# Altium schematic sheet SC945D_Backlight.SchDoc: Backlight
size 393 x 270 mm; CompanyName: Seccom; Address1: 521, rue du capt. François Garbit; Address2: 69440 Mornant; Address3: seccom@seccom.fr; Address4: www.seccom.fr; DocumentNumber: 8; SheetNumber: 8; SheetTotal: 9; PageSetup: Record=PageOptions|CenterHorizontal=True|CenterVertical=True|PrintScale=0.74|XCorrection=1.00|YCorrection=1.00|PrintKind=0|BorderSize=5000000|LeftOffset=0|BottomOffset=0|Orientation=2|PaperLength=1000|PaperWidth=1000|Scale=100|PaperSource=7|PrintQuality=-4|MediaType=1|DitherType=10|PaperKind=A4|PrintScaleMode=1
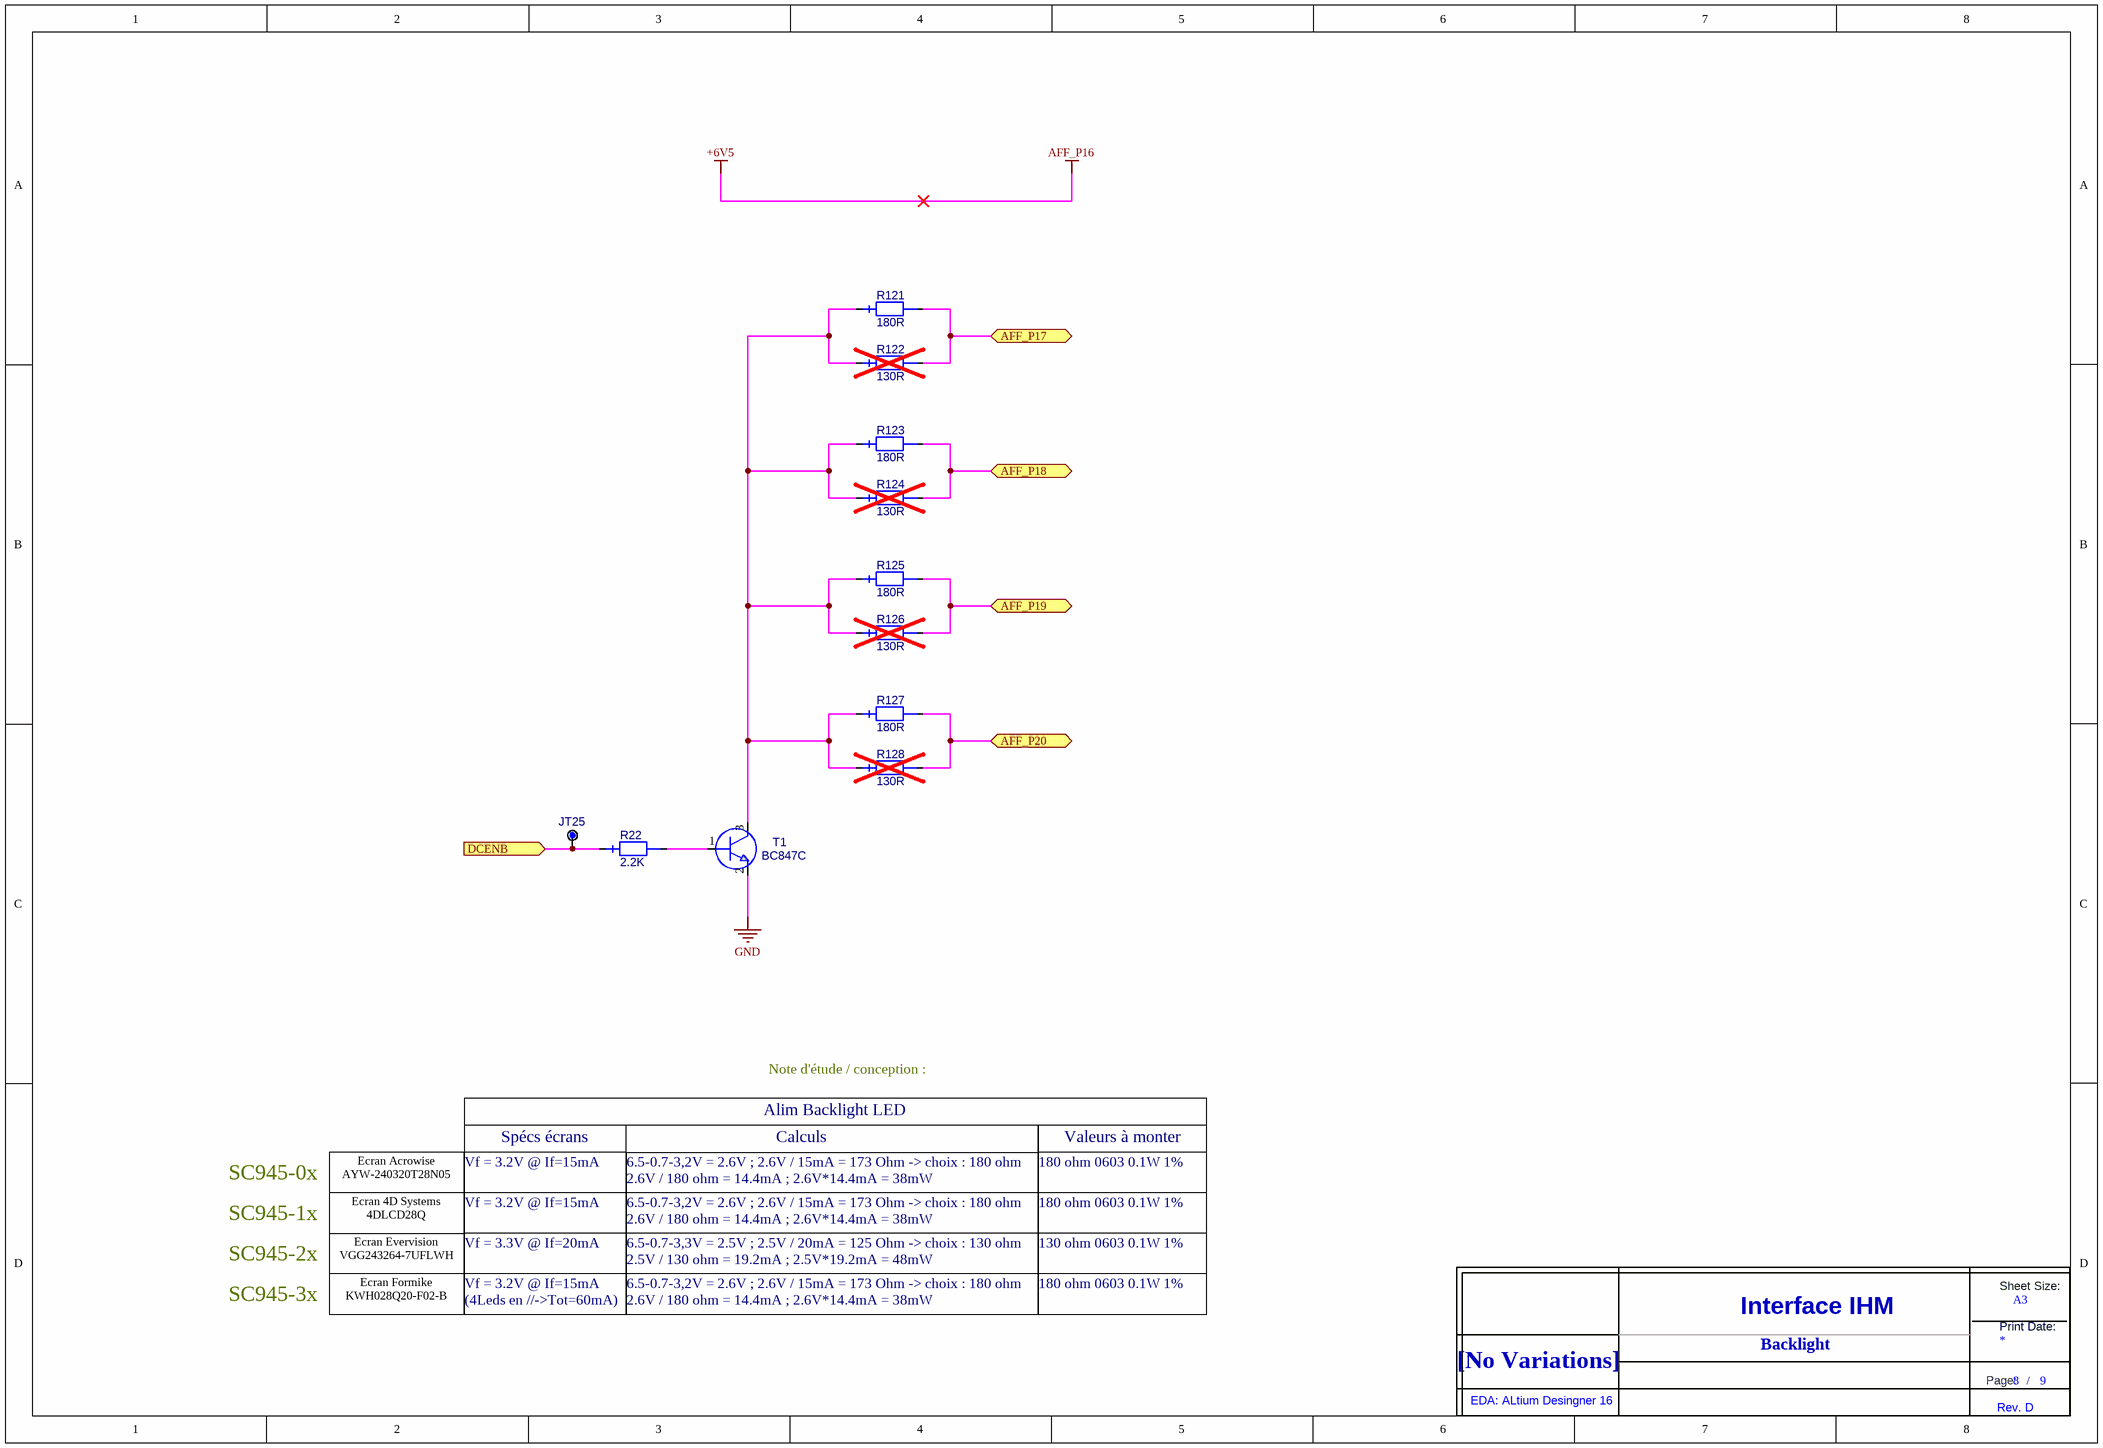
[diagram p0: SC945D_Backlight.SchDoc]

## Parts
JT25  POINT_TEST_PAD_40MIL  [PAD_CMS_40X40_E]  (value not drawn)  (no BOM)
R22  value 2.2K  [0603_ReflowSoldering_RES]  (hidden comment: RES_0603_1%_100PPM_2.2K)
R121  value 180R  [0603_ReflowSoldering_RES]  (hidden comment: RES_0603_1%_100PPM_180R)
R122  value 130R  [0603_ReflowSoldering_RES]  (hidden comment: RES_0603_1%_100PPM_130R)  (no BOM)
R123  value 180R  [0603_ReflowSoldering_RES]  (hidden comment: RES_0603_1%_100PPM_180R)
R124  value 130R  [0603_ReflowSoldering_RES]  (hidden comment: RES_0603_1%_100PPM_130R)  (no BOM)
R125  value 180R  [0603_ReflowSoldering_RES]  (hidden comment: RES_0603_1%_100PPM_180R)
R126  value 130R  [0603_ReflowSoldering_RES]  (hidden comment: RES_0603_1%_100PPM_130R)  (no BOM)
R127  value 180R  [0603_ReflowSoldering_RES]  (hidden comment: RES_0603_1%_100PPM_180R)
R128  value 130R  [0603_ReflowSoldering_RES]  (hidden comment: RES_0603_1%_100PPM_130R)  (no BOM)
T1  BC847C  [SOT23_3L_ReflowSoldering]
Title_new?  DNI  (value not drawn)  (graphical)

## Ports
AFF_P17 (bidir), AFF_P18 (bidir), AFF_P19 (bidir), AFF_P20 (bidir), DCENB (in)

## Nets
GND: T1.2(E)
AFF_P17: R121.2 R122.2 ; port AFF_P17
AFF_P18: R123.2 R124.2 ; port AFF_P18
AFF_P19: R125.2 R126.2 ; port AFF_P19
AFF_P20: R127.2 R128.2 ; port AFF_P20
DCENB: JT25.1 R22.1 ; port DCENB
NetR22_2: R22.2 T1.1(B)
NetR121_1: R121.1 R122.1 R123.1 R124.1 R125.1 R126.1 R127.1 R128.1 T1.3(C)

## Notes on the sheet
- Alim Backlight LED
- Note d'étude / conception :
- SC945-0x
- Ecran Acrowise
  AYW-240320T28N05
- Spécs écrans
- Vf = 3.2V @ If=15mA
- Calculs
- 6.5-0.7-3,2V = 2.6V ; 2.6V / 15mA = 173 Ohm -> choix : 180 ohm
  2.6V / 180 ohm = 14.4mA ; 2.6V*14.4mA = 38mW
- Valeurs à monter
- 180 ohm 0603 0.1W 1%
- SC945-1x
- SC945-2x
- Ecran 4D Systems
  4DLCD28Q
- SC945-3x
- Ecran Evervision
  VGG243264-7UFLWH
- Ecran Formike
  KWH028Q20-F02-B
- Vf = 3.3V @ If=20mA
- Vf = 3.2V @ If=15mA
  (4Leds en //->Tot=60mA)
- 6.5-0.7-3,3V = 2.5V ; 2.5V / 20mA = 125 Ohm -> choix : 130 ohm
  2.5V / 130 ohm = 19.2mA ; 2.5V*19.2mA = 48mW
- 130 ohm 0603 0.1W 1%
- Backlight
- (in symbol Title_new) Sheet Size:; A3; Interface IHM; Print Date:; [No Variations]; Page:; /; EDA: ALtium Desingner 16; Rev. D

## Library data of the parts
JT25 = POINT_TEST_PAD_40MIL: Point de test sur CI, pad de diamètre 1.016mm (40mils); Creation: FB (04/10/12); Remarque: {Remarque}; Coeff: 1; Value: POINT_TEST; Config: *; ComponentLink1Description: Datasheet; ComponentLink2Description: Datasheet Boitier
R22 = RES_0603_1%_100PPM_2.2K: Résistance, 0.100W, 1%, 100ppm, 75V, 2.2K; Creation: JPL (05/07/12); Boitier: 0603; Remarque: {Remarque}; Fabricant: Vishay; Ref Fab: CRCW06032K20FKEA; Coeff: 1; Verification: *; ComponentLink1URL: O:\_Documentation\Datasheets\Vishay\Resistances_D-CRCWe3.pdf; ComponentLink2URL: o:\_Documentation\Datasheets\_BOITIERS\PASSIF_CMS\; Config: *; ComponentLink1Description: Datasheet; ComponentLink2Description: Datasheet Boitier; Supplier 1: Farnell; Supplier 2: RadioSpares; Supplier Part Number 1: 1469765; Supplier Part Number 2: 6790112
R121 R123 R125 R127 = RES_0603_1%_100PPM_180R: Résistance, 0.100W, 1%, 100ppm, 75V, 180R; Creation: FB (06/09/12); Boitier: 0603; Remarque: {Remarque}; Fabricant: Vishay; Ref Fab: CRCW0603180RFKEA; Coeff: 1; Verification: *; ComponentLink1URL: O:\_Documentation\Datasheets\Vishay\Resistances_D-CRCWe3.pdf; ComponentLink2URL: o:\_Documentation\Datasheets\_BOITIERS\PASSIF_CMS\; Config: *; ComponentLink1Description: Datasheet; ComponentLink2Description: Datasheet Boitier; Supplier 1: Farnell; Supplier Part Number 1: 1469762; Supplier 2: Mouser; Supplier Part Number 2: 71-CRCW0603-180-E3
R122 R124 R126 R128 = RES_0603_1%_100PPM_130R: Résistance, 0.100W, 1%, 100ppm, 75V, 130R; Creation: FB (10/09/12); Boitier: 0603; Remarque: {Remarque}; Fabricant: Vishay; Ref Fab: CRCW0603130RFKEA; Coeff: 1; Verification: *; ComponentLink1URL: O:\_Documentation\Datasheets\Vishay\Resistances_D-CRCWe3.pdf; ComponentLink2URL: o:\_Documentation\Datasheets\_BOITIERS\PASSIF_CMS\; Config: *; ComponentLink1Description: Datasheet; ComponentLink2Description: Datasheet Boitier; Supplier 1: Farnell; Supplier Part Number 1: 2141288; Supplier 2: Mouser; Supplier Part Number 2: 71-CRCW0603-130-E3
T1 = BC847C: Transistor NPN, Vce=50V, Ic=0.1A, hfe=420~800, 0.25W, CMS; Creation: GO (08/07/05); Verification: LJ (21/07/05); Reference: 000329/00; Boitier: SOT23_3L; Remarque: Complementaires aux BC856-860; Coeff: 1; Fabricant: NXP; ComponentLink1URL: O:\_Documentation\Datasheets\NXP\BC847.pdf; ComponentLink2URL: o:\_Documentation\Datasheets\_BOITIERS\ACTIF_CMS\SOT\SOT_23_3P_(Schneider).PDF; Config: *; ComponentLink1Description: Datasheet; Value: BC847C; Supplier 1: Farnell; Supplier Part Number 1: 1081235; Ref Fab: BC847C; ComponentLink2Description: Datasheet Boitier
Title_new? = Title_new